# Altium schematic sheet 12_TEC.SchDoc
size 420 x 297 mm; SheetNumber: 19; SheetTotal: 29
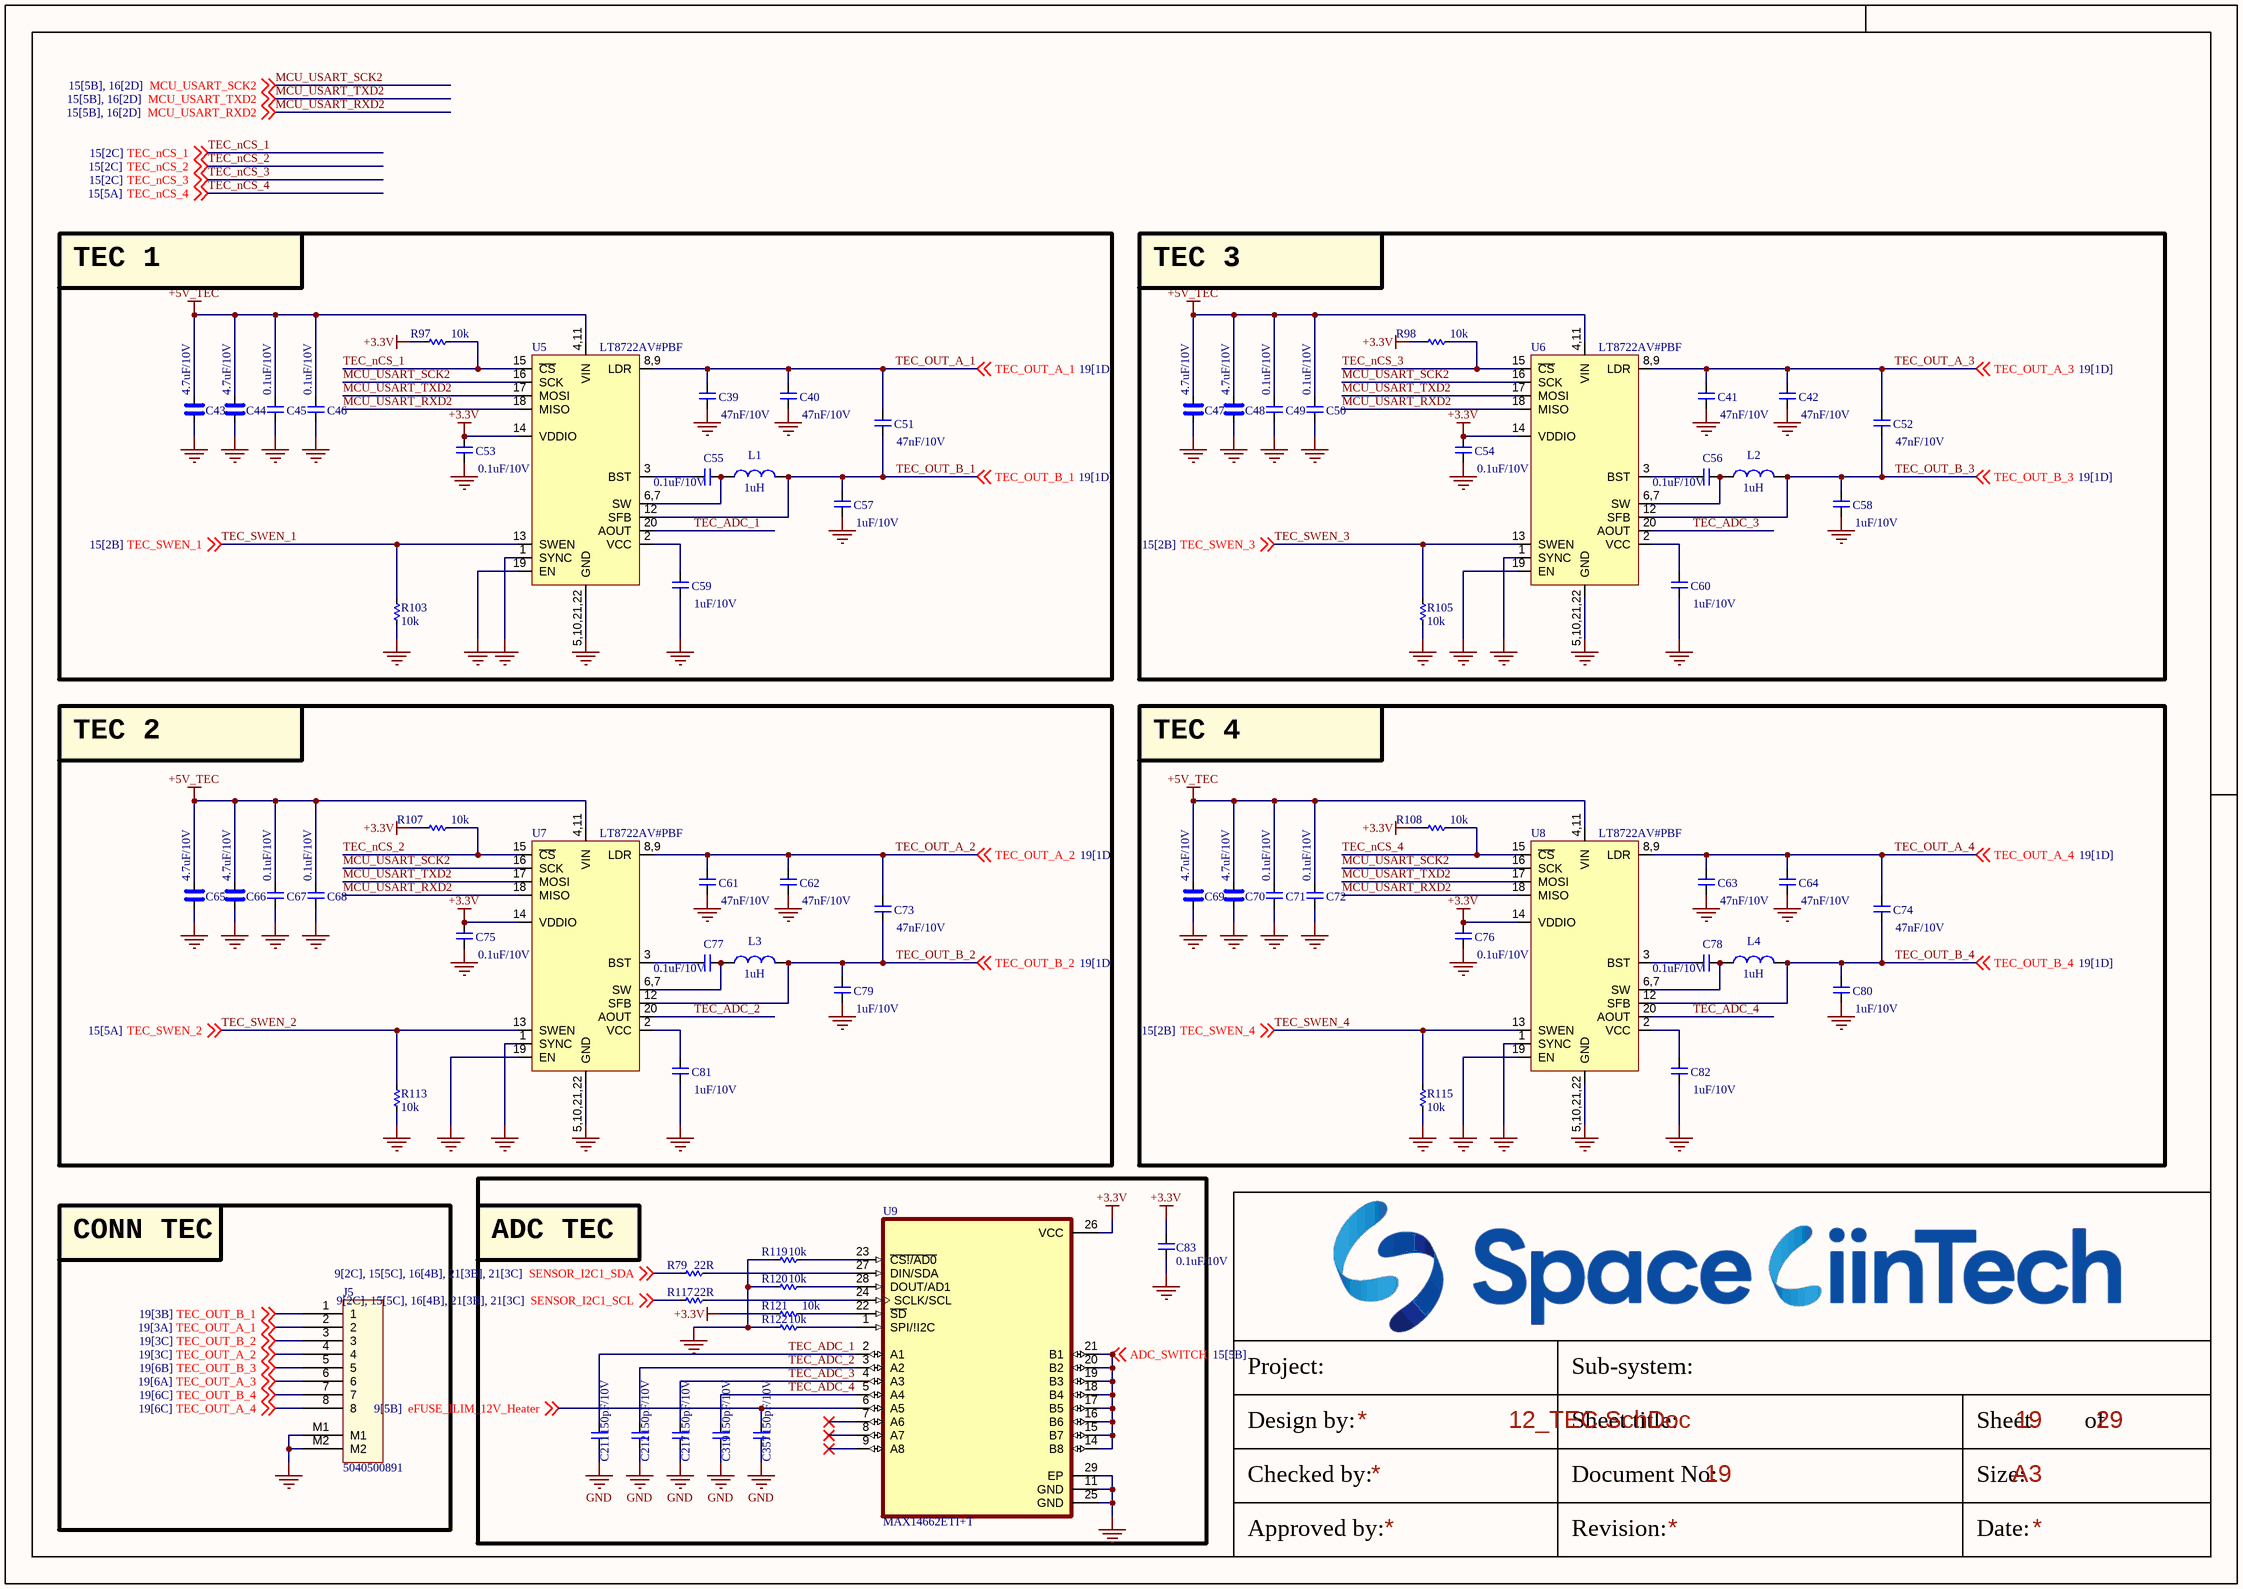
[diagram p0: 12_TEC.SchDoc]

## Parts
C39  47nF/10V  [CAP_C_1005X60]
C40  47nF/10V  [CAP_C_1005X60]
C41  47nF/10V  [CAP_C_1005X60]
C42  47nF/10V  [CAP_C_1005X60]
C43  4.7uF/10V  [CAP_C_1005X60]
C44  4.7uF/10V  [CAP_C_1005X60]
C45  0.1uF/10V  [CAP_C_1005X60]
C46  0.1uF/10V  [CAP_C_1005X60]
C47  4.7uF/10V  [CAP_C_1005X60]
C48  4.7uF/10V  [CAP_C_1005X60]
C49  0.1uF/10V  [CAP_C_1005X60]
C50  0.1uF/10V  [CAP_C_1005X60]
C51  47nF/10V  [CAP_C_1005X60]
C52  47nF/10V  [CAP_C_1005X60]
C53  0.1uF/10V  [CAP_C_1005X60]
C54  0.1uF/10V  [CAP_C_1005X60]
C55  0.1uF/10V  [CAP_C_1005X60]
C56  0.1uF/10V  [CAP_C_1005X60]
C57  1uF/10V  [CAP_C_1005X60]
C58  1uF/10V  [CAP_C_1005X60]
C59  1uF/10V  [CAP_C_1005X60]
C60  1uF/10V  [CAP_C_1005X60]
C61  47nF/10V  [CAP_C_1005X60]
C62  47nF/10V  [CAP_C_1005X60]
C63  47nF/10V  [CAP_C_1005X60]
C64  47nF/10V  [CAP_C_1005X60]
C65  4.7uF/10V  [CAP_C_1005X60]
C66  4.7uF/10V  [CAP_C_1005X60]
C67  0.1uF/10V  [CAP_C_1005X60]
C68  0.1uF/10V  [CAP_C_1005X60]
C69  4.7uF/10V  [CAP_C_1005X60]
C70  4.7uF/10V  [CAP_C_1005X60]
C71  0.1uF/10V  [CAP_C_1005X60]
C72  0.1uF/10V  [CAP_C_1005X60]
C73  47nF/10V  [CAP_C_1005X60]
C74  47nF/10V  [CAP_C_1005X60]
C75  0.1uF/10V  [CAP_C_1005X60]
C76  0.1uF/10V  [CAP_C_1005X60]
C77  0.1uF/10V  [CAP_C_1005X60]
C78  0.1uF/10V  [CAP_C_1005X60]
C79  1uF/10V  [CAP_C_1005X60]
C80  1uF/10V  [CAP_C_1005X60]
C81  1uF/10V  [CAP_C_1005X60]
C82  1uF/10V  [CAP_C_1005X60]
C83  0.1uF/10V  [CAP_C_1005X60]
C211  150pF/10V  [CAP_C_1005X60]
C212  150pF/10V  [CAP_C_1005X60]
C217  150pF/10V  [CAP_C_1005X60]
C319  150pF/10V  [CAP_C_1005X60]
C357  150pF/10V  [CAP_C_1005X60]
J5  5040500891  [MOLEX_5040500891]
L1  1uH  [L-SMD-M-3.5x3.5x2mm]
L2  1uH  [L-SMD-M-3.5x3.5x2mm]
L3  1uH  [L-SMD-M-3.5x3.5x2mm]
L4  1uH  [L-SMD-M-3.5x3.5x2mm]
R79  22R  [RES_C_1005X40]
R97  10k  [RES_C_1005X40]
R98  10k  [RES_C_1005X40]
R103  10k  [RES_C_1005X40]
R105  10k  [RES_C_1005X40]
R107  10k  [RES_C_1005X40]
R108  10k  [RES_C_1005X40]
R113  10k  [RES_C_1005X40]
R115  10k  [RES_C_1005X40]
R117  22R  [RES_C_1005X40]
R119  10k  [RES_C_1005X40]
R120  10k  [RES_C_1005X40]
R121  10k  [RES_C_1005X40]
R122  10k  [RES_C_1005X40]
U5  LT8722AV#PBF  [QFN18]
U6  LT8722AV#PBF  [QFN18]
U7  LT8722AV#PBF  [QFN18]
U8  LT8722AV#PBF  [QFN18]
U9  MAX14662ETI+T  [QFN40P400X400X80-29N]

## Blocks framed on the sheet
TEC 1: C39 C40 C43-C46 C51 C53 C55 C57 C59 L1 R97 R103 U5
TEC 3: C41 C42 C47-C50 C52 C54 C56 C58 C60 L2 R98 R105 U6
TEC 2: C61 C62 C65-C68 C73 C75 C77 C79 C81 L3 R107 R113 U7
TEC 4: C63 C64 C69-C72 C74 C76 C78 C80 C82 L4 R108 R115 U8
ADC TEC: C83 C211 C212 C217 C319 C357 R79 R117 R119-R122 U9
CONN TEC: J5

## Nets
+3.3V: C53.2 C54.2 C75.2 C76.2 C83.2 R97.1 R98.1 R107.1 R108.1 R121.1 U5.14(VDDIO) U6.14(VDDIO) U7.14(VDDIO) U8.14(VDDIO) U9.26(VCC)
+5V_TEC: C43.2 C44.2 C45.2 C46.2 C47.2 C48.2 C49.2 C50.2 C65.2 C66.2 C67.2 C68.2 C69.2 C70.2 C71.2 C72.2 U5.4,11(VIN) U6.4,11(VIN) U7.4,11(VIN) U8.4,11(VIN)
GND: C39.1 C40.1 C41.1 C42.1 C43.1 C44.1 C45.1 C46.1 C47.1 C48.1 C49.1 C50.1 C53.1 C54.1 C57.1 C58.1 C59.1 C60.1 C61.1 C62.1 C63.1 C64.1 C65.1 C66.1 C67.1 C68.1 C69.1 C70.1 C71.1 C72.1 C75.1 C76.1 C79.1 C80.1 C81.1 C82.1 C83.1 C211.1 C212.1 C217.1 C319.1 C357.1 J5.M1 J5.M2 R103.2 R105.2 R113.2 R115.2 R119.1 R120.1 R122.1 U5.1(SYNC) U5.5,10,21,22(GND) U5.19(EN) U6.1(SYNC) U6.5,10,21,22(GND) U6.19(EN) U7.1(SYNC) U7.5,10,21,22(GND) U7.19(EN) U8.1(SYNC) U8.5,10,21,22(GND) U8.19(EN) U9.11(GND) U9.25(GND) U9.29(EP)
ADC_SWITCH: U9.14(B8) U9.15(B7) U9.16(B6) U9.17(B5) U9.18(B4) U9.19(B3) U9.20(B2) U9.21(B1) ; off-sheet ADC_SWITCH
eFUSE_ILIM_12V_Heater: C357.2 U9.6(A5) ; off-sheet eFUSE_ILIM_12V_Heater
MCU_USART_RXD2: U5.18(MISO) U6.18(MISO) U7.18(MISO) U8.18(MISO) ; off-sheet MCU_USART_RXD2
MCU_USART_SCK2: U5.16(SCK) U6.16(SCK) U7.16(SCK) U8.16(SCK) ; off-sheet MCU_USART_SCK2
MCU_USART_TXD2: U5.17(MOSI) U6.17(MOSI) U7.17(MOSI) U8.17(MOSI) ; off-sheet MCU_USART_TXD2
SENSOR_I2C1_SCL: R117.1 ; off-sheet SENSOR_I2C1_SCL
SENSOR_I2C1_SDA: R79.1 ; off-sheet SENSOR_I2C1_SDA
TEC_ADC_1: C211.2 U5.20(AOUT) U9.2(A1)
TEC_ADC_2: C212.2 U7.20(AOUT) U9.3(A2)
TEC_ADC_3: C217.2 U6.20(AOUT) U9.4(A3)
TEC_ADC_4: C319.2 U8.20(AOUT) U9.5(A4)
TEC_nCS_1: R97.2 U5.15(~{CS}) ; off-sheet TEC_nCS_1
TEC_nCS_2: R107.2 U7.15(~{CS}) ; off-sheet TEC_nCS_2
TEC_nCS_3: R98.2 U6.15(~{CS}) ; off-sheet TEC_nCS_3
TEC_nCS_4: R108.2 U8.15(~{CS}) ; off-sheet TEC_nCS_4
TEC_OUT_A_1: C39.2 C40.2 C51.2 J5.2 U5.8,9(LDR) ; off-sheet TEC_OUT_A_1
TEC_OUT_A_2: C61.2 C62.2 C73.2 J5.4 U7.8,9(LDR) ; off-sheet TEC_OUT_A_2
TEC_OUT_A_3: C41.2 C42.2 C52.2 J5.6 U6.8,9(LDR) ; off-sheet TEC_OUT_A_3
TEC_OUT_A_4: C63.2 C64.2 C74.2 J5.8 U8.8,9(LDR) ; off-sheet TEC_OUT_A_4
TEC_OUT_B_1: C51.1 C57.2 J5.1 L1.2 U5.12(SFB) ; off-sheet TEC_OUT_B_1
TEC_OUT_B_2: C73.1 C79.2 J5.3 L3.2 U7.12(SFB) ; off-sheet TEC_OUT_B_2
TEC_OUT_B_3: C52.1 C58.2 J5.5 L2.2 U6.12(SFB) ; off-sheet TEC_OUT_B_3
TEC_OUT_B_4: C74.1 C80.2 J5.7 L4.2 U8.12(SFB) ; off-sheet TEC_OUT_B_4
TEC_SWEN_1: R103.1 U5.13(SWEN) ; off-sheet TEC_SWEN_1
TEC_SWEN_2: R113.1 U7.13(SWEN) ; off-sheet TEC_SWEN_2
TEC_SWEN_3: R105.1 U6.13(SWEN) ; off-sheet TEC_SWEN_3
TEC_SWEN_4: R115.1 U8.13(SWEN) ; off-sheet TEC_SWEN_4
NetC55_1: C55.1 L1.1 U5.6,7(SW)
NetC55_2: C55.2 U5.3(BST)
NetC56_1: C56.1 L2.1 U6.6,7(SW)
NetC56_2: C56.2 U6.3(BST)
NetC59_2: C59.2 U5.2(VCC)
NetC60_2: C60.2 U6.2(VCC)
NetC77_1: C77.1 L3.1 U7.6,7(SW)
NetC77_2: C77.2 U7.3(BST)
NetC78_1: C78.1 L4.1 U8.6,7(SW)
NetC78_2: C78.2 U8.3(BST)
NetC81_2: C81.2 U7.2(VCC)
NetC82_2: C82.2 U8.2(VCC)
NetR79_2: R79.2 U9.27(DIN/SDA)
NetR117_2: R117.2 U9.24(SCLK/SCL)
NetR119_2: R119.2 U9.23(~{CS!/AD0})
NetR120_2: R120.2 U9.28(DOUT/AD1)
NetR121_2: R121.2 U9.22(~{SD})
NetR122_2: R122.2 U9.1(SPI/!I2C)

Not connected (* = marked no-connect by the designer): U9 7(A6)* 8(A7)* 9(A8)*

## Notes on the sheet
- Project:
- Sub-system:
- Design by:
- Sheet title:
- Sheet
- of
- Checked by:
- Approved by:
- Revision:
- Document No:
- Size:
- Date:
- A3

## Library data of the parts
C39-C42 C45 C46 C49-C64 C67 C68 C71-C83 C211 C212 C217 C319 C357 = _CAP_C_2: CAP CHIP
C43 C44 C47 C48 C65 C66 C69 C70 = _CAP_C_High_2: CAP CHIP High Value
J5 = Header 8x1_2M
L1-L4 = L-SMD-1: partNo: 78477010; Manufacturer: Wurth Elektronik; Inductance: 1.0 μH; ComponentLink1Description: Manufacturer; ComponentLink1URL: http://www.we-online.de; Created by: Baojun Chen; Created Date: Nov.2015; ComponentLink2Description: Datasheet; ComponentLink2URL: http://katalog.we-online.de/pbs/datasheet/78477010.pdf
R79 R97 R98 R103 R105 R107 R108 R113 R115 R117 R119-R122 = _RES_B_2: RES
U5-U8 = LT8722
U9 = IC_SW_MAX14662ETI+T: 8 Circuit IC Switch 1:1 1Ohm 28-TQFN _4x4_; MF: Maxim Integrated; Package: TQFN-28 Maxim; Value: *; Price: None; MP: MAX14662ETI+T; SnapEDA_Link: https://www.snapeda.com/parts/MAX14662ETI%2BT/Maxim%20Integrated/view-part/546683/?ref=snap; Availability: Unavailable